# EAGLE design HyperArmBoardREV2 (EAGLE 8.6.0)
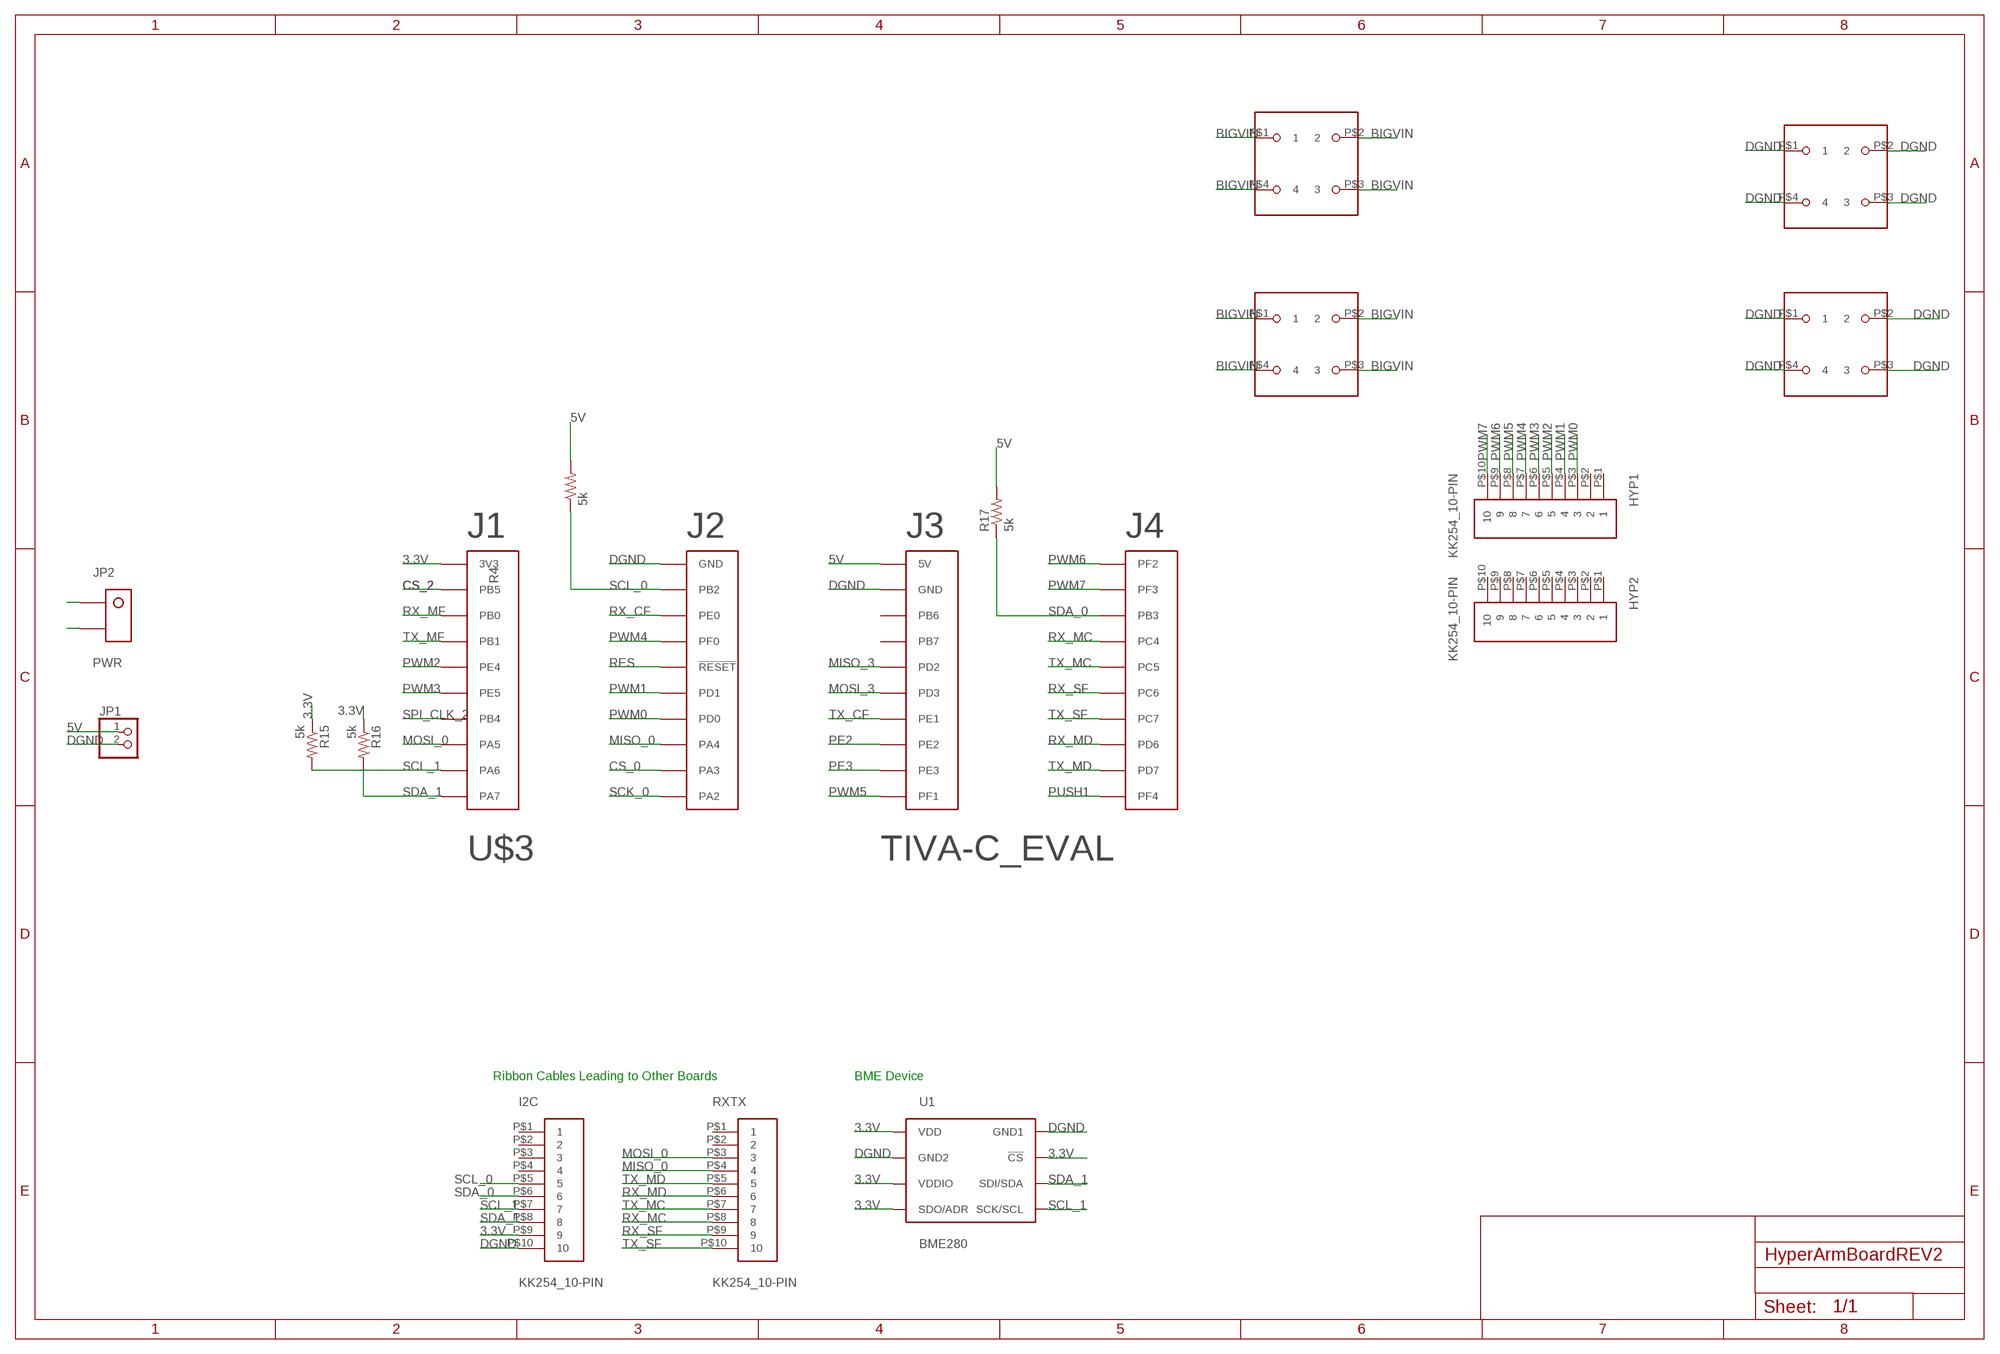
[diagram p0: schematic, sheet 1]

## Parts
HYP1  KK254_10-PIN  [KK254_10-PIN]
HYP2  KK254_10-PIN  [KK254_10-PIN]
I2C  KK254_10-PIN  [KK254_10-PIN]
JP1  PINHD-1X2  [1X02]
JP2  PWR  2_SUPERSABRE  [SUPERSABRE_2CIRCUIT]
R4  5k  R-US_R0805  [R0805]
R15  5k  R-US_R0805  [R0805]
R16  5k  R-US_R0805  [R0805]
R17  5k  R-US_R0805  [R0805]
RXTX  KK254_10-PIN  [KK254_10-PIN]
U1  BME280  [BME280_LGA]
U$3  TIVA-C_EVAL  [TIVA-C_EVAL]
U$4  BCS-106-L-D-PE-BE  [4-PIN-BIGPOWER]
U$5  BCS-106-L-D-PE-BE  [4-PIN-BIGPOWER]
U$6  BCS-106-L-D-PE-BE  [4-PIN-BIGPOWER]
U$7  BCS-106-L-D-PE-BE  [4-PIN-BIGPOWER]

## Nets
3.3V: I2C.P$9 R15.1 R16.1 U1.P$2(!CS) U1.P$5(SDO/ADR) U1.P$6(VDDIO) U1.P$8(VDD) U$3.1-1(3V3)
5V: JP1.1 R4.2 R17.2 U$3.3-1(5V)
BIGVIN: JP2.P$1 U$4.P$1 U$4.P$2 U$4.P$3 U$4.P$4 U$5.P$1 U$5.P$2 U$5.P$3 U$5.P$4
CS_0: U$3.2-9(PA3)
CS_2: U$3.1-2(PB5)
DGND: I2C.P$10 JP1.2 JP2.P$2 U1.P$1(GND1) U1.P$7(GND2) U$3.2-1(GND) U$3.3-2(GND) U$6.P$1 U$6.P$2 U$6.P$3 U$6.P$4 U$7.P$1 U$7.P$2 U$7.P$3 U$7.P$4
MISO_0: RXTX.P$4 U$3.2-8(PA4)
MISO_3: U$3.3-5(PD2)
MOSI_0: RXTX.P$3 U$3.1-8(PA5)
MOSI_3: U$3.3-6(PD3)
PE2: U$3.3-8(PE2)
PE3: U$3.3-9(PE3)
PUSH1: U$3.4-10(PF4)
PWM0: HYP1.P$3 U$3.2-7(PD0)
PWM1: HYP1.P$4 U$3.2-6(PD1)
PWM2: HYP1.P$5 U$3.1-5(PE4)
PWM3: HYP1.P$6 U$3.1-6(PE5)
PWM4: HYP1.P$7 U$3.2-4(PF0)
PWM5: HYP1.P$8 U$3.3-10(PF1)
PWM6: HYP1.P$9 U$3.4-1(PF2)
PWM7: HYP1.P$10 U$3.4-2(PF3)
RES: U$3.2-5(!RESET!)
RX_CF: U$3.2-3(PE0)
RX_MC: RXTX.P$8 U$3.4-4(PC4)
RX_MD: RXTX.P$6 U$3.4-8(PD6)
RX_MF: U$3.1-3(PB0)
RX_SF: RXTX.P$9 U$3.4-6(PC6)
SCK_0: U$3.2-10(PA2)
SCL_0: I2C.P$5 R4.1 U$3.2-2(PB2)
SCL_1: I2C.P$7 R15.2 U1.P$4(SCK/SCL) U$3.1-9(PA6)
SDA_0: I2C.P$6 R17.1 U$3.4-3(PB3)
SDA_1: I2C.P$8 R16.2 U1.P$3(SDI/SDA) U$3.1-10(PA7)
SPI_CLK_2: U$3.1-7(PB4)
TX_CF: U$3.3-7(PE1)
TX_MC: RXTX.P$7 U$3.4-5(PC5)
TX_MD: RXTX.P$5 U$3.4-9(PD7)
TX_MF: U$3.1-4(PB1)
TX_SF: RXTX.P$10 U$3.4-7(PC7)
Unconnected: HYP1.P$1 HYP1.P$2 HYP2.P$1 HYP2.P$2 HYP2.P$3 HYP2.P$4 HYP2.P$5 HYP2.P$6 HYP2.P$7 HYP2.P$8 HYP2.P$9 HYP2.P$10 I2C.P$1 I2C.P$2 I2C.P$3 I2C.P$4 RXTX.P$1 RXTX.P$2 U$3.3-3(PB6) U$3.3-4(PB7)

## Notes on the sheet
- Ribbon Cables Leading to Other Boards | BME Device

## Library data of the parts
HYP1 HYP2 I2C RXTX = molex:KK254_10-PIN: KK254 10-pin Datasheet <http://www.molex.com/molex/products/datasheet.jsp?part=active/0022102101_PCB_HEADERS.xml>
JP1 = pinhead:PINHD-1X2: PIN HEADER
JP2 = molex:2_SUPERSABRE: Molex SuperSabre 2-pin vertical header
R4 R15-R17 = resistor:R-US_: RESISTOR, American symbol
U1 = BME280ComponentLibrary:BME280; PROD_ID: IC-13090
U$3 = texas:TIVA-C_EVAL: Texas Instruments Tiva-C TM4C123G LaunchPad Evaluation Board Part number EK-TM4C123GXL Datasheet <http://www.ti.com/lit/ug/spmu296/spmu296.pdf> Microcontroller <http://www.ti.com/lit/ds/spms376e/spms376e.pdf>
U$4-U$7 = samtec:BCS-106-L-D-PE-BE

## Board
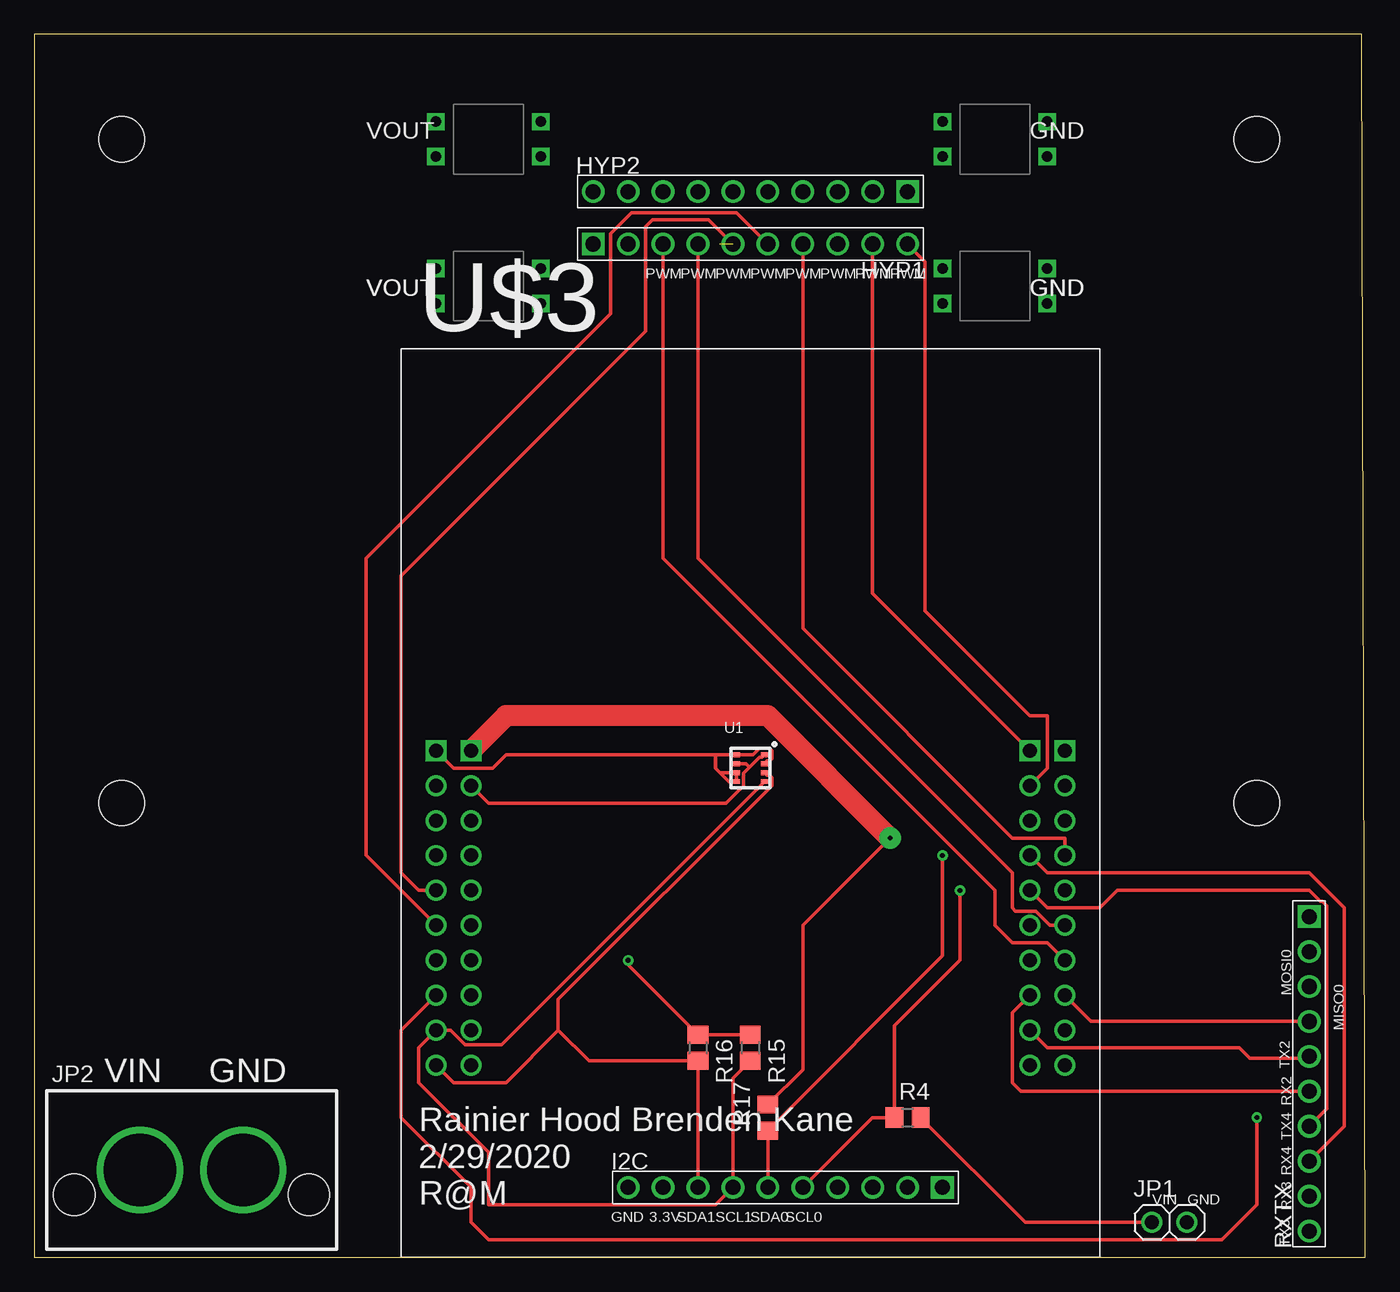
[diagram p1: board, top side]
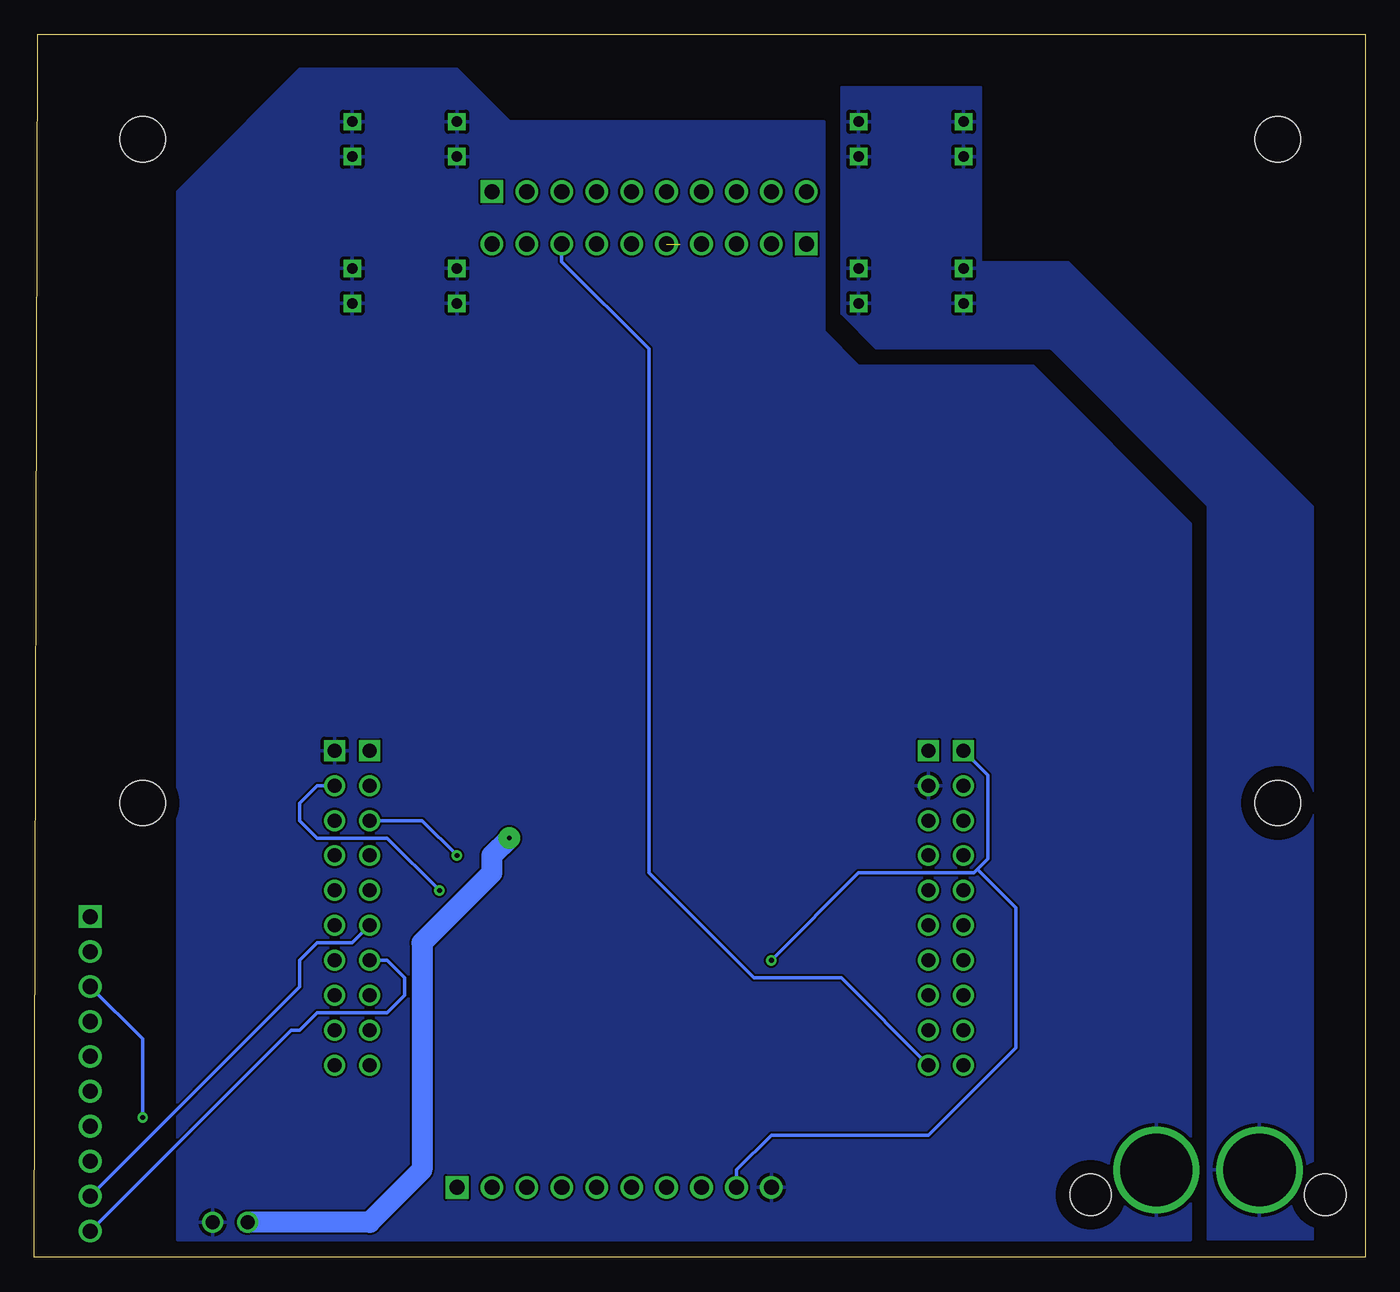
[diagram p2: board, bottom side, seen from below]

Size 96.77 x 88.9 mm. Coordinates in mm from the lower left corner, seen from the top.
Outline: 0,0 96.77,0 96.52,88.9 0,88.9 0,0
Copper layers (1*16): Top 0.035mm / dielectric 1.5mm / Bottom 0.035mm
Design rules "default": minimum track width 6mil, minimum drill 0.35mm, track to track 6mil, track to pad 6mil, pad to pad 6mil, via to via 6mil, smd to smd 6mil, copper to edge 40mil, drill to drill 6mil, minimum pad ring 10mil, minimum via ring 8mil, stop-mask expansion 4mil, vias tented up to drill 0mil, thermal gap 10mil
Holes 3.3 mm at 6.35,33.02 88.9,81.28 88.9,33.02 6.35,81.28

### Footprints (pad centres in the part's own frame; a part is rotated, then mirrored left to right if it is on the bottom)
KK254_10-PIN = drill 1.1 square: P$1 11.43,0 | drill 1.1: P$2 8.89,0; P$3 6.35,0; P$4 3.81,0; P$5 1.27,0; P$6 -1.27,0; P$7 -3.81,0; P$8 -6.35,0; P$9 -8.89,0; P$10 -11.43,0
1X02 = drill 1.016: 1 -1.27,0; 2 1.27,0
SUPERSABRE_2CIRCUIT = drill 5.25: P$1 -3.747,0; P$2 3.747,0 | hole 2.997: -8.534,-1.803; 8.534,-1.803
R0805 = smd 1.3 x 1.5: 1 -0.95,0; 2 0.95,0
BME280_LGA = smd 0.5 x 0.35: P$1 1.025,0.975; P$2 1.025,0.325; P$3 1.025,-0.325; P$4 1.025,-0.975; P$5 -1.025,-0.975; P$6 -1.025,-0.325; P$7 -1.025,0.325; P$8 -1.025,0.975
TIVA-C_EVAL = drill 1.016 square: 1-1 -22.86,3.81; 2-1 22.86,3.81; 3-1 -20.32,3.81; 4-1 20.32,3.81 | drill 1.016: 1-2 -22.86,1.27; 1-3 -22.86,-1.27; 1-4 -22.86,-3.81; 1-5 -22.86,-6.35; 1-6 -22.86,-8.89; 1-7 -22.86,-11.43; 1-8 -22.86,-13.97; 1-9 -22.86,-16.51; 1-10 -22.86,-19.05; 2-2 22.86,1.27; 2-3 22.86,-1.27; 2-4 22.86,-3.81; 2-5 22.86,-6.35; 2-6 22.86,-8.89; 2-7 22.86,-11.43; 2-8 22.86,-13.97; 2-9 22.86,-16.51; 2-10 22.86,-19.05; 3-2 -20.32,1.27; 3-3 -20.32,-1.27; 3-4 -20.32,-3.81; 3-5 -20.32,-6.35; 3-6 -20.32,-8.89; 3-7 -20.32,-11.43; 3-8 -20.32,-13.97; 3-9 -20.32,-16.51; 3-10 -20.32,-19.05; 4-2 20.32,1.27; 4-3 20.32,-1.27; 4-4 20.32,-3.81; 4-5 20.32,-6.35; 4-6 20.32,-8.89; 4-7 20.32,-11.43; 4-8 20.32,-13.97; 4-9 20.32,-16.51; 4-10 20.32,-19.05
4-PIN-BIGPOWER = drill 0.762 square: P$1 -1.27,3.81; P$2 1.27,3.81; P$3 1.27,-3.81; P$4 -1.27,-3.81

### Placement (x,y rotation side)
HYP1  52.07,73.66 180 top
HYP2  52.07,77.47 0 top
I2C  54.61,5.08 0 top
JP1  82.55,2.54 0 top
JP2  11.43,6.35 0 top
R4  63.5,10.16 0 top
R15  52.07,15.24 270 top
R16  48.26,15.24 270 top
R17  53.34,10.16 90 top
RXTX  92.71,13.34 90 top
U1  52.07,35.56 0 top
U$3  52.07,33.02 0 top
U$4  33.02,81.28 270 top
U$5  33.02,70.61 90 top
U$6  69.85,70.61 90 top
U$7  69.85,81.28 90 top

### Tracks (layer width: path | path; a pad name or v marks a point on that pad's centre or on a via)
3.3V  (via drill 0.35)
  Top 0.254: 49.53,36.53 U1.P$8 52.27,36.53 52.73,36.99 53.46,36.99 53.62,36.83 53.62,36.24 53.46,36.08 53.29,36.08 U1.P$2 | 49.53,36.53 34.29,36.53 33.31,35.56 30.48,35.56 U$3.1-1 | 49.53,36.53 49.53,35.56 49.85,35.23 | 49.85,35.23 50.51,34.59 U1.P$5 U1.P$6 49.85,35.23 | R15.1 R16.1 43.18,21.27 v43.18,21.59
  Bottom 0.254: v43.18,21.59 36.83,27.94 28.45,27.94 28.19,28.19 | 28.19,28.19 27.43,28.96 27.43,35.05 U$3.1-1 | 28.19,28.19 25.4,25.4 25.4,15.24 31.75,8.89 43.18,8.89 45.72,6.35 I2C.P$9
5V  (via drill 0.35 pad 1.55)
  Top 0.254: R4.2 72.07,2.54 JP1.1 | R17.2 55.88,13.65 55.88,24.13 v62.23,30.48
  Top 1.524: v62.23,30.48 53.34,39.37 34.29,39.37 U$3.3-1
  Bottom 1.524: JP1.1 72.39,2.54 68.58,6.35 68.58,22.86 63.5,27.94 63.5,29.21 v62.23,30.48
BIGVIN
  pour Bottom: 3.81,10.16 3.81,1.27 11.43,1.27 11.43,54.61 12.7,55.88 22.86,66.04 35.56,66.04 38.1,68.58 38.1,85.09 27.94,85.09 27.94,72.39 21.59,72.39 3.81,54.61
DGND
  Top 0.254: U1.P$1 52.9,36.34 52.73,36.34 52.01,35.62 | 52.01,35.62 51.57,35.19 51.57,34.29 50.3,33.02 33.02,33.02 U$3.3-2 | U1.P$7 51.74,35.88 52.01,35.62
  pour Bottom: 12.7,1.27 12.7,53.34 24.13,64.77 36.83,64.77 39.37,67.31 39.37,82.55 62.23,82.55 66.04,86.36 77.47,86.36 85.09,78.74 86.36,77.47 86.36,1.27
MISO_0
  Top 0.254: U$3.2-8 76.83,17.14 RXTX.P$4
MOSI_0  (via drill 0.35)
  Top 0.254: U$3.1-8 26.67,16.51 26.67,10.16 31.75,5.08 31.75,2.54 33.02,1.27 34.29,1.27 86.36,1.27 88.9,3.81 v88.9,10.16
  Bottom 0.254: v88.9,10.16 88.9,15.88 RXTX.P$3
PWM0
  Top 0.254: HYP1.P$3 45.72,50.8 69.85,26.67 69.85,24.13 71.12,22.86 73.66,22.86 U$3.2-7
PWM1
  Top 0.254: U$3.2-6 73.86,24.13 72.82,25.17 71.35,25.17 71.12,25.4 71.12,27.94 48.26,50.8 HYP1.P$4
PWM2  (1 unrouted)
  Top 0.254: U$3.1-5 27.94,26.67 26.67,27.94 26.67,49.53 44.45,67.31 44.45,74.93 44.96,75.44 49.02,75.44 HYP1.P$5
PWM3
  Top 0.254: U$3.1-6 24.13,29.21 24.13,50.8 41.91,68.58 41.91,74.42 43.43,75.95 51.05,75.95 HYP1.P$6
PWM4
  Top 0.254: HYP1.P$7 55.88,45.72 71.12,30.48 74.93,30.48 U$3.2-4
PWM5
  Bottom 0.254: HYP1.P$8 58.42,72.39 52.07,66.04 52.07,27.94 44.45,20.32 38.1,20.32 U$3.3-10
PWM6
  Top 0.254: HYP1.P$9 60.96,48.26 U$3.4-1
PWM7
  Top 0.254: HYP1.P$10 64.77,72.39 64.77,46.99 72.39,39.37 73.66,39.37 73.66,35.56 U$3.4-2
RX_MC
  Top 0.254: U$3.4-4 73.66,27.94 92.71,27.94 95.25,25.4 95.25,9.53 RXTX.P$8
RX_MD
  Top 0.254: U$3.4-8 71.12,17.78 71.12,12.7 71.75,12.06 73.03,12.06 73.66,12.06 RXTX.P$6
RX_SF
  Bottom 0.254: RXTX.P$9 77.47,19.68 77.47,21.59 76.2,22.86 73.66,22.86 U$3.4-6
SCL_0  (via drill 0.35)
  Top 0.254: I2C.P$5 60.96,10.16 R4.1 62.55,16.83 67.31,21.59 v67.31,26.67
  Bottom 0.254: v67.31,26.67 71.12,30.48 76.2,30.48 77.47,31.75 77.47,33.02 76.2,34.29 U$3.2-2
SCL_1
  Top 0.254: U1.P$4 33.98,15.47 31.32,15.47 30.28,16.51 U$3.1-9 27.94,15.24 27.94,12.7 33.02,7.62 33.02,3.81 49.53,3.81 I2C.P$7 50.8,13.02 R15.2
SDA_0  (via drill 0.35)
  Top 0.254: I2C.P$6 R17.1 66.04,21.91 v66.04,29.21
  Bottom 0.254: v66.04,29.21 68.58,31.75 U$3.4-3
SDA_1
  Top 0.254: U1.P$3 53.29,35.04 53.46,35.04 53.62,34.88 53.62,34.29 38.1,18.77 38.1,16.51 | 38.1,16.51 34.29,12.7 30.48,12.7 U$3.1-10 | 38.1,16.51 40.32,14.29 R16.2 I2C.P$8
TX_MC
  Top 0.254: RXTX.P$7 93.98,10.79 93.98,25.54 93.65,25.87 93.51,25.87 92.71,26.67 78.74,26.67 77.47,25.4 73.66,25.4 U$3.4-5
TX_MD
  Top 0.254: U$3.4-9 73.66,15.24 87.63,15.24 88.39,14.48 92.58,14.48 RXTX.P$5
TX_SF
  Bottom 0.254: RXTX.P$10 78.11,16.51 77.47,16.51 76.2,17.78 71.12,17.78 69.85,19.05 69.85,20.32 71.12,21.59 U$3.4-7

### Text on the board
tPlace: VOUT | GND | PWM | PWM | PWM | PWM | PWM | PWM | PWM | PWM | VOUT | GND | MOSI0 | MISO0 | TX2 | VIN | GND | RX2 | TX4 | RX4 | Rainier Hood Brenden Kane / 2/29/2020 / R@M | VIN | GND | GND | 3.3V | SDA1 | SCL1 | SDA0 | SCL0 | RX3 | TX3
tSilk: VOUT | GND